# EAGLE design C64_ProtoBreakOut_Stabilized (EAGLE 9.0.1)
CNAME: Uffes Cart; CREVISION: 1.0; DESIGNER: Tomse @ http://retro-commodore.eu
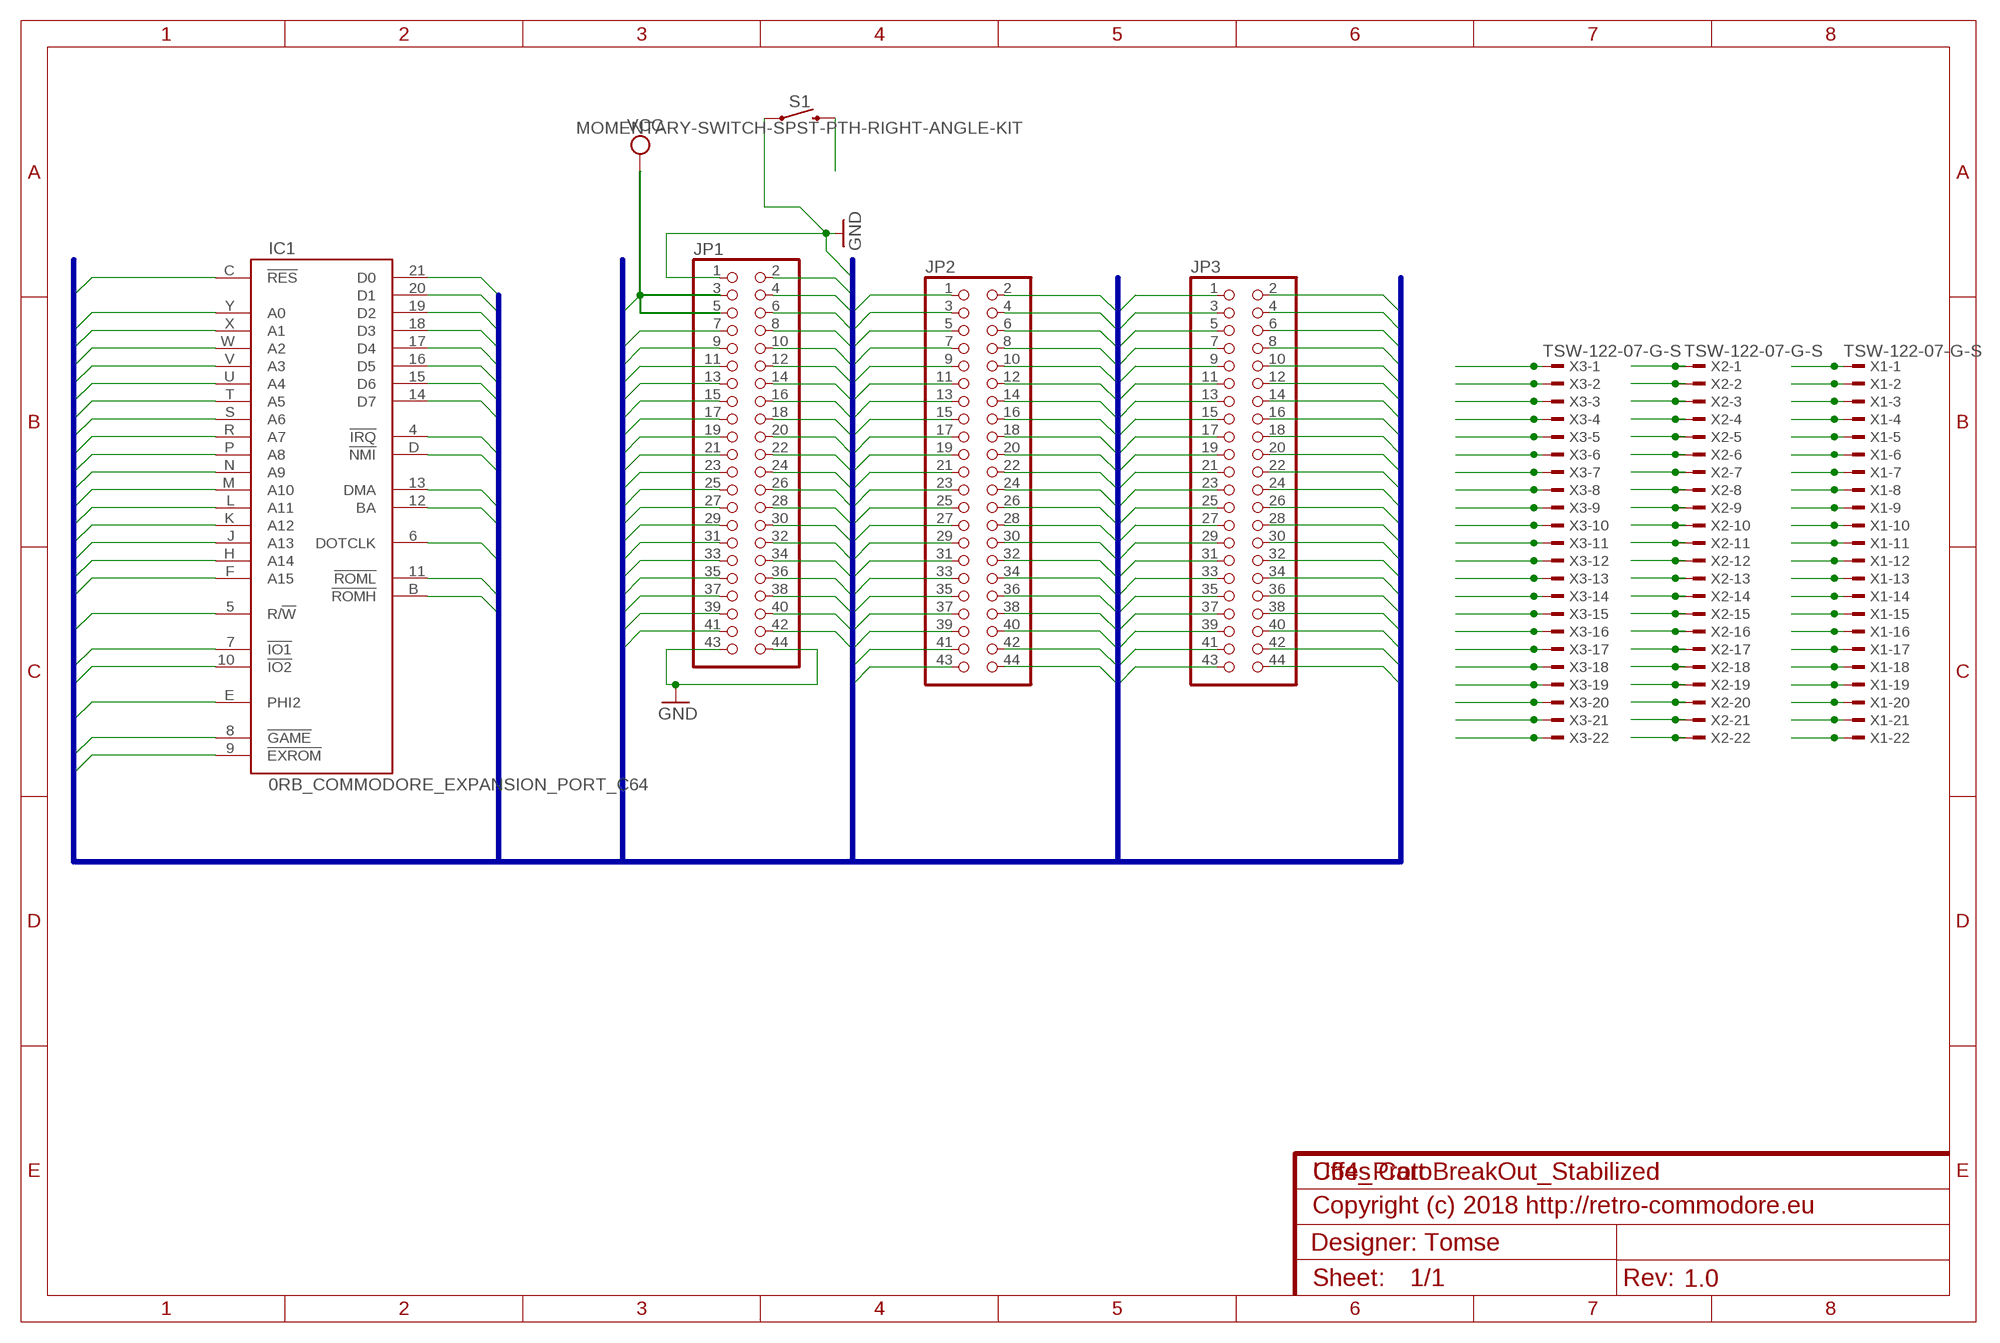
[diagram p0: schematic, sheet 1]
FRAME1 (FRAME-A4L): DESIGNER: Copyright (c) 2018 http://retro-commodore.eu

## Parts
IC1  0RB_COMMODORE_EXPANSION_PORT_C64  [0RB_COMMODORE_MA100-22-2]
JP1  PINHD-2X22  [2X22]
JP2  PINHD-2X22  [2X22]
JP3  PINHD-2X22  [2X22]
S1  MOMENTARY-SWITCH-SPST-PTH-RIGHT-ANGLE-KIT  [TACTILE_SWITCH_PTH_RIGHT_ANGLE_KIT]
X1  TSW-122-07-G-S  [TSW-122-XX-G-S]
X2  TSW-122-07-G-S  [TSW-122-XX-G-S]
X3  TSW-122-07-G-S  [TSW-122-XX-G-S]

## Nets
!DMA: IC1.13(DMA) JP1.25 JP2.25 JP3.25 X1.13 X2.13 X3.13
!EXROM: IC1.9(!EXROM) JP1.17 JP2.17 JP3.17 X1.9 X2.9 X3.9
!GAME: IC1.8(!GAME) JP1.15 JP2.15 JP3.15 X1.8 X2.8 X3.8
!IO1: IC1.7(!IO1) JP1.13 JP2.13 JP3.13 X1.7 X2.7 X3.7
!IO2: IC1.10(!IO2) JP1.19 JP2.19 JP3.19 X1.10 X2.10 X3.10
!IRQ: IC1.4(!IRQ) JP1.7 JP2.7 JP3.7 X1.4 X2.4 X3.4
!NMI: IC1.D(!NMI) JP1.8 JP2.8 JP3.8
!RES: IC1.C(!RES) JP1.6 JP2.6 JP3.6 S1.2
!ROMH: IC1.B(!ROMH) JP1.4 JP2.4 JP3.4
!ROML: IC1.11(!ROML) JP1.21 JP2.21 JP3.21 X1.11 X2.11 X3.11
A0: IC1.Y(A0) JP1.42 JP2.42 JP3.42
A1: IC1.X(A1) JP1.40 JP2.40 JP3.40
A2: IC1.W(A2) JP1.38 JP2.38 JP3.38
A3: IC1.V(A3) JP1.36 JP2.36 JP3.36
A4: IC1.U(A4) JP1.34 JP2.34 JP3.34
A5: IC1.T(A5) JP1.32 JP2.32 JP3.32
A6: IC1.S(A6) JP1.30 JP2.30 JP3.30
A7: IC1.R(A7) JP1.28 JP2.28 JP3.28
A8: IC1.P(A8) JP1.26 JP2.26 JP3.26
A9: IC1.N(A9) JP1.24 JP2.24 JP3.24
A10: IC1.M(A10) JP1.22 JP2.22 JP3.22
A11: IC1.L(A11) JP1.20 JP2.20 JP3.20
A12: IC1.K(A12) JP1.18 JP2.18 JP3.18
A13: IC1.J(A13) JP1.16 JP2.16 JP3.16
A14: IC1.H(A14) JP1.14 JP2.14 JP3.14
A15: IC1.F(A15) JP1.12 JP2.12 JP3.12
BA: IC1.12(BA) JP1.23 JP2.23 JP3.23 X1.12 X2.12 X3.12
D0: IC1.21(D0) JP1.41 JP2.41 JP3.41 X1.21 X2.21 X3.21
D1: IC1.20(D1) JP1.39 JP2.39 JP3.39 X1.20 X2.20 X3.20
D2: IC1.19(D2) JP1.37 JP2.37 JP3.37 X1.19 X2.19 X3.19
D3: IC1.18(D3) JP1.35 JP2.35 JP3.35 X1.18 X2.18 X3.18
D4: IC1.17(D4) JP1.33 JP2.33 JP3.33 X1.17 X2.17 X3.17
D5: IC1.16(D5) JP1.31 JP2.31 JP3.31 X1.16 X2.16 X3.16
D6: IC1.15(D6) JP1.29 JP2.29 JP3.29 X1.15 X2.15 X3.15
D7: IC1.14(D7) JP1.27 JP2.27 JP3.27 X1.14 X2.14 X3.14
DOTCLK: IC1.6(DOTCLK) JP1.11 JP2.11 JP3.11 X1.6 X2.6 X3.6
GND: JP1.1 JP1.2 JP1.43 JP1.44 JP2.1 JP2.2 JP2.43 JP2.44 JP3.1 JP3.2 JP3.43 JP3.44 S1.1 X1.1 X1.22 X2.1 X2.22 X3.1 X3.22
PHI2: IC1.E(PHI2) JP1.10 JP2.10 JP3.10
R!W: IC1.5(R/!W) JP1.9 JP2.9 JP3.9 X1.5 X2.5 X3.5
VCC: JP1.3 JP1.5 JP2.3 JP2.5 JP3.3 JP3.5 X1.2 X1.3 X2.2 X2.3 X3.2 X3.3

## Buses
A0,A1,A2,A3,A4,A5,A6,A7,A8,A9,A10,A11,A12,A13,A14,A15,PHI2,!NMI,!RES,!ROMH,GND,D0,D1,D2,D3,D4,D5,D6,D7,VCC,!IRQ,R!W,DOTCLK,!IO1,!IO2,!GAME,!EXROM,!ROML,BA,!DMA

## Notes on the sheet
- Designer: Tomse

## Power pins joined to a net without a drawn wire
GND: IC1.1(GND) IC1.22(GND) IC1.A(GND) IC1.Z(GND)
VCC: IC1.2(VCC) IC1.3(VCC)

## Library data of the parts
IC1 = C64CartridgeEdgeConnector:0RB_COMMODORE_EXPANSION_PORT_C64
JP1-JP3 = pinhead:PINHD-2X22: PIN HEADER
S1 = SparkFun-Switches:MOMENTARY-SWITCH-SPST: Momentary Switch (Pushbutton) - SPST Normally-open (NO) SPST momentary switches (buttons, pushbuttons). Variants PTH-12MM - 12mm square, through-hole Momentary Pushbutton Switch - 12mm Square <https://www.sparkfun.com/products/9190> (COM-09190) PTH-6.0MM, PTH-6.0MM-KIT - 6.0mm square, through-hole Mini Pushbutton Switch <https://www.sparkfun.com/products/97> (COM-00097) KIT package intended for soldering kit's - only one side of pads' copper is exposed. PTH-RIGHT-ANGLE-KIT - Right-angle, through-hole Right Angle Tactile Button <https://www.sparkfun.com/products/10791> - Used on SparkFun BigTime Watch Kit <https://www.sparkfun.com/products/11734> SMD-12MM - 12mm square, surface-mount Tactile Button - SMD (12mm) <https://www.sparkfun.com/products/12993> (COM-12993) Used on SparkFun PicoBoard <https://www.sparkfun.com/products/11888> SMD-4.5MM - 4.5mm Square Trackball Switch Used on SparkFun Blackberry Trackballer Breakout <https://www.sparkfun.com/products/13169> SMD-4.6MMX2.8MM - 4.60mm x 2.80mm, surface mount Used on SparkFun SAMD21 Mini Breakout <https://www.sparkfun.com/products/13664> SMD-5.2MM, SMD-5.2-REDUNDANT - 5.2mm square, surface-mount Mini Pushbutton Switch - SMD <https://www.sparkfun.com/products/8720> (COM-08720) Used on Arduino Pro Mini <https://www.sparkfun.com/products/11114> REDUNDANT package connects both switch circuits together SMD-6.0X3.5MM - 6.0 x 3.5mm, surface mount Momentary Reset Switch SMD <https://www.sparkfun.com/products/8229> (COM-08229) SMD-6.2MM-TALL - 6.2mm square, surface mount Tactile Button - SMD (6mm) <https://www.sparkfun.com/products/12992> Used on SparkFun Digital Sandbox <https://www.sparkfun.com/products/12651> SMD-RIGHT-ANGLE - Right-angle, surface mount Used on SparkFun Block for Intel® Edison - Arduino <https://www.sparkfun.com/products/13036>; PROD_ID: CONN-10672; SF_SKU: COM-10791
X1-X3 = con-samtec:TSW-122-*-G-S: THROUGH-HOLE .025" SQ POST HEADER Source: Samtec TSW.pdf; MF: Samtec Inc.; MPN: TSW-122-07-G-S

## Net classes
0 default: clearance 0.205 mm

## Board
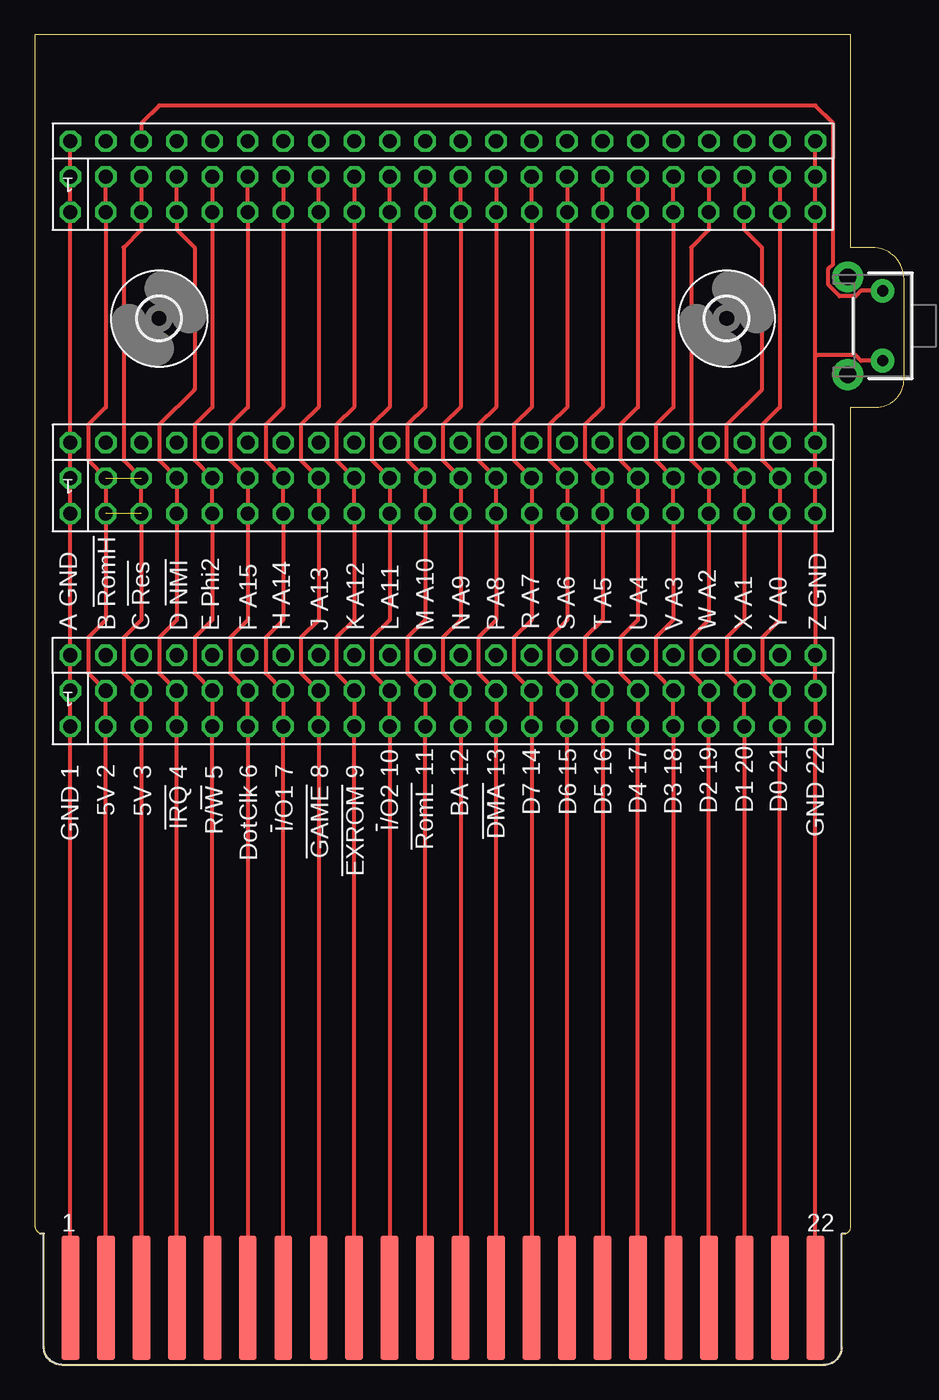
[diagram p1: board, top side]
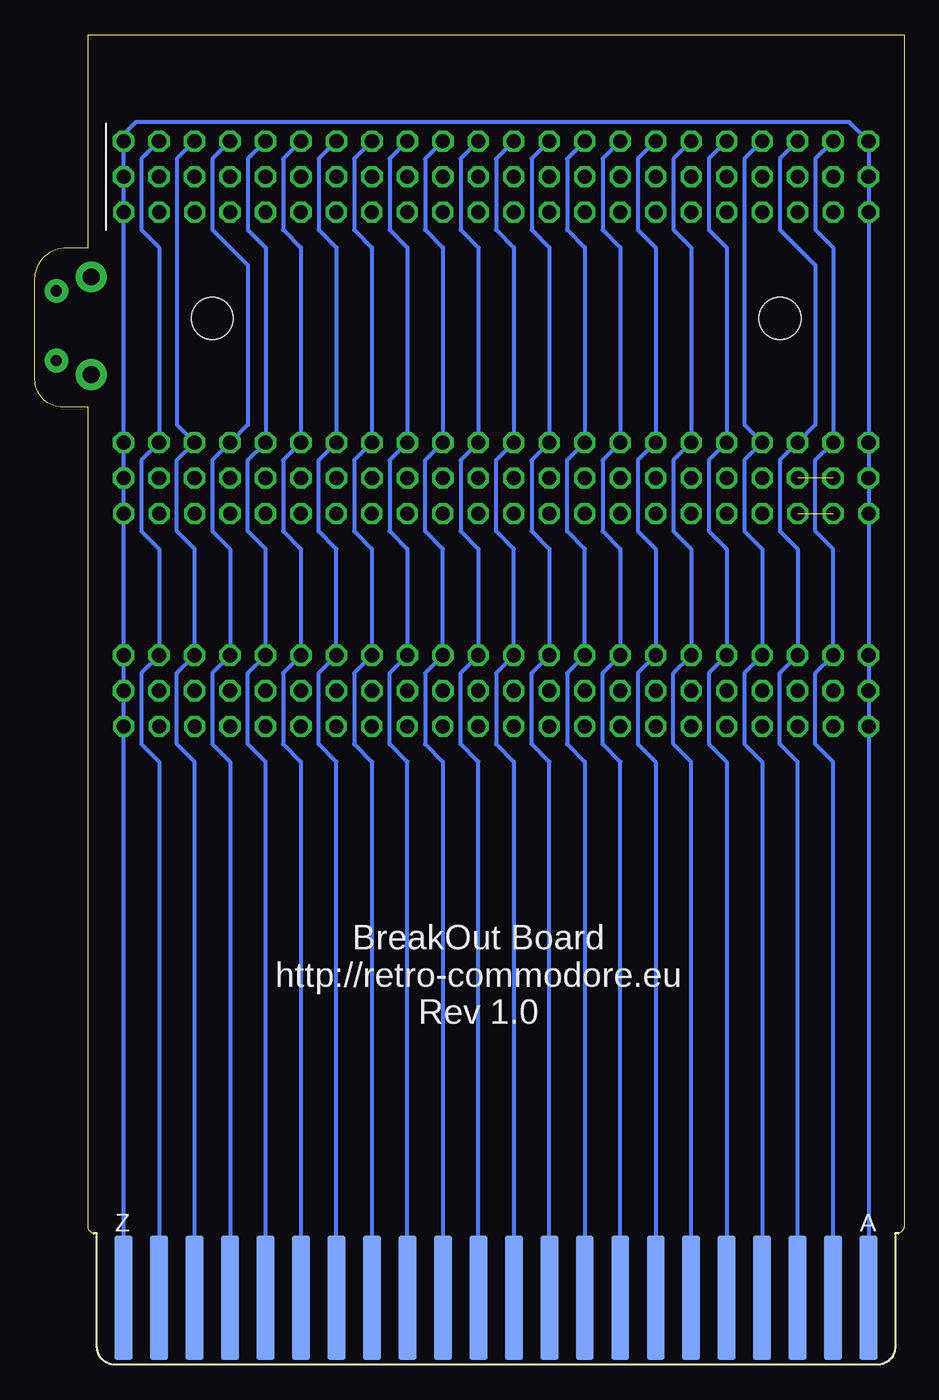
[diagram p2: board, bottom side, seen from below]

Size 62.23 x 95.24 mm. Coordinates in mm from the lower left corner, seen from the top.
Outline: 0.64,9.3 0.64,1.24 arc90 1.87,0 56.52,0 arc90 57.8,1.28 57.8,9.29 arc-90 57.91,9.4 57.94,9.4 arc90 58.42,9.87 58.42,68.58 60.24,68.58 arc90 62.23,70.57 62.23,77.74 arc90 59.96,80.01 58.42,80.01 58.42,95.24 0,95.24 0,9.93 arc90 0.53,9.4 arc-90 0.64,9.3
Copper layers (1*16): Top 0.035mm / dielectric 1.5mm / Bottom 0.035mm
Design rules "default": minimum track width 6mil, minimum drill 0.35mm, track to track 6mil, track to pad 6mil, pad to pad 6mil, via to via 6mil, smd to smd 6mil, copper to edge 40mil, drill to drill 6mil, minimum pad ring 10mil, minimum via ring 8mil, stop-mask expansion 4mil, vias tented up to drill 0mil, thermal gap 10mil

### Footprints (pad centres in the part's own frame; a part is rotated, then mirrored left to right if it is on the bottom)
0RB_COMMODORE_MA100-22-2 = smd 1.27 x 8.89: 1 -26.67,-0.305; 2 -24.13,-0.305; 3 -21.59,-0.305; 4 -19.05,-0.305; 5 -16.51,-0.305; 6 -13.97,-0.305; 7 -11.43,-0.305; 8 -8.89,-0.305; 9 -6.35,-0.305; 10 -3.81,-0.305; 11 -1.27,-0.305; 12 1.27,-0.305; 13 3.81,-0.305; 14 6.35,-0.305; 15 8.89,-0.305; 16 11.43,-0.305; 17 13.97,-0.305; 18 16.51,-0.305; 19 19.05,-0.305; 20 21.59,-0.305; 21 24.13,-0.305; 22 26.67,-0.305 | smd 1.27 x 8.89 bottom: A -26.67,-0.305; B -24.13,-0.305; C -21.59,-0.305; D -19.05,-0.305; E -16.51,-0.305; F -13.97,-0.305; H -11.43,-0.305; J -8.89,-0.305; K -6.35,-0.305; L -3.81,-0.305; M -1.27,-0.305; N 1.27,-0.305; P 3.81,-0.305; R 6.35,-0.305; S 8.89,-0.305; T 11.43,-0.305; U 13.97,-0.305; V 16.51,-0.305; W 19.05,-0.305; X 21.59,-0.305; Y 24.13,-0.305; Z 26.67,-0.305
2X22 = drill 1.016 octagon: 1 -25.4,-1.27; 2 -25.4,1.27; 3 -22.86,-1.27; 4 -22.86,1.27; 5 -20.32,-1.27; 6 -20.32,1.27; 7 -17.78,-1.27; 8 -17.78,1.27; 9 -15.24,-1.27; 10 -15.24,1.27; 11 -12.7,-1.27; 12 -12.7,1.27; 13 -10.16,-1.27; 14 -10.16,1.27; 15 -7.62,-1.27; 16 -7.62,1.27; 17 -5.08,-1.27; 18 -5.08,1.27; 19 -2.54,-1.27; 20 -2.54,1.27; 21 0,-1.27; 22 0,1.27; 23 2.54,-1.27; 24 2.54,1.27; 25 5.08,-1.27; 26 5.08,1.27; 27 7.62,-1.27; 28 7.62,1.27; 29 10.16,-1.27; 30 10.16,1.27; 31 12.7,-1.27; 32 12.7,1.27; 33 15.24,-1.27; 34 15.24,1.27; 35 17.78,-1.27; 36 17.78,1.27; 37 20.32,-1.27; 38 20.32,1.27; 39 22.86,-1.27; 40 22.86,1.27; 41 25.4,-1.27; 42 25.4,1.27; 43 27.94,-1.27; 44 27.94,1.27
TACTILE_SWITCH_PTH_RIGHT_ANGLE_KIT = drill 0.8 pad 1.7: 1 -2.5,0; 2 2.5,0 | drill 1.2 pad 2.2: ANCHOR1 -3.5,2.5; ANCHOR2 3.5,2.5
3,0 = hole 3: 0,0
TSW-122-XX-G-S = drill 1 pad 1.5 octagon: 1 26.67,0; 2 24.13,0; 3 21.59,0; 4 19.05,0; 5 16.51,0; 6 13.97,0; 7 11.43,0; 8 8.89,0; 9 6.35,0; 10 3.81,0; 11 1.27,0; 12 -1.27,0; 13 -3.81,0; 14 -6.35,0; 15 -8.89,0; 16 -11.43,0; 17 -13.97,0; 18 -16.51,0; 19 -19.05,0; 20 -21.59,0; 21 -24.13,0; 22 -26.67,0

### Placement (x,y rotation side)
IC1  29.21,5.08 0 top
JP1  27.94,64.77 0 top
JP2  27.94,49.53 0 top
JP3  27.94,86.36 0 top
S1  60.69,74.41 90 top
U$1  [3,0]  8.89,74.93 0 top
U$2  [3,0]  49.53,74.93 0 top
X1  29.21,45.72 180 top
X2  29.21,60.96 180 top
X3  29.21,82.55 180 top

### Tracks (layer width: path | path; a pad name or v marks a point on that pad's centre or on a via)
!DMA
  Top 0.3: JP3.25 X3.13 33.02,68.58 31.75,67.31 31.75,64.77 JP1.25 X2.13 33.02,53.34 31.75,52.07 31.75,49.53 JP2.25 X1.13 IC1.13
!EXROM
  Top 0.3: JP3.17 X3.9 22.86,68.58 21.59,67.31 21.59,64.77 JP1.17 X2.9 22.86,53.34 21.59,52.07 21.59,49.53 JP2.17 X1.9 IC1.9
!GAME
  Top 0.3: JP3.15 X3.8 20.32,68.58 19.05,67.31 19.05,64.77 JP1.15 X2.8 20.32,53.34 19.05,52.07 19.05,49.53 JP2.15 X1.8 IC1.8
!IO1
  Top 0.3: JP3.13 X3.7 17.78,68.58 16.51,67.31 16.51,64.77 JP1.13 X2.7 17.78,53.34 16.51,52.07 16.51,49.53 JP2.13 X1.7 IC1.7
!IO2
  Top 0.3: JP3.19 X3.10 25.4,68.58 24.13,67.31 24.13,64.77 JP1.19 X2.10 25.4,53.34 24.13,52.07 24.13,49.53 JP2.19 X1.10 IC1.10
!IRQ
  Top 0.3: JP3.7 X3.4 10.16,81.28 11.43,80.01 11.43,69.85 8.89,67.31 8.89,64.77 JP1.7 X2.4 10.16,53.34 8.89,52.07 8.89,49.53 JP2.7 X1.4 IC1.4
!NMI
  Bottom 0.3: JP3.8 11.43,86.36 11.43,69.85 11.43,68.58 11.43,67.31 JP1.8 11.43,64.77 11.43,59.69 10.16,58.42 JP2.8 11.43,49.53 11.43,44.45 10.16,43.18 IC1.D
!RES
  Top 0.3: S1.2 59.15,76.91 58.77,76.53 57.62,76.53 56.81,77.34 56.81,78.48 57.15,78.82 57.15,88.9 55.88,90.17 8.89,90.17 7.62,88.9 JP3.6
  Bottom 0.3: JP3.6 8.89,86.36 8.89,81.28 6.35,78.74 6.35,68.58 6.35,67.31 JP1.6 8.89,64.77 8.89,59.69 7.62,58.42 JP2.6 8.89,49.53 8.89,44.45 7.62,43.18 IC1.C
!ROMH
  Bottom 0.3: IC1.B 5.08,43.18 6.35,44.45 6.35,49.53 JP2.4 5.08,58.42 6.35,59.69 6.35,64.77 JP1.4 5.08,80.01 6.35,81.28 6.35,86.36 JP3.4
!ROML
  Top 0.3: JP3.21 X3.11 27.94,68.58 26.67,67.31 26.67,64.77 JP1.21 X2.11 27.94,53.34 26.67,52.07 26.67,49.53 JP2.21 X1.11 IC1.11
A0
  Bottom 0.3: JP3.42 54.61,86.36 54.61,81.28 53.34,80.01 JP1.42 54.61,64.77 54.61,59.69 53.34,58.42 JP2.42 54.61,49.53 54.61,44.45 53.34,43.18 IC1.Y
A1
  Bottom 0.3: JP3.40 52.07,86.36 52.07,67.31 JP1.40 52.07,64.77 52.07,59.69 50.8,58.42 JP2.40 52.07,49.53 52.07,44.45 50.8,43.18 IC1.X
A2
  Bottom 0.3: JP3.38 49.53,86.36 49.53,81.28 46.99,78.74 46.99,67.31 JP1.38 49.53,64.77 49.53,59.69 48.26,58.42 JP2.38 49.53,49.53 49.53,44.45 48.26,43.18 IC1.W
A3
  Bottom 0.3: JP3.36 46.99,86.36 46.99,81.28 45.72,80.01 JP1.36 46.99,64.77 46.99,59.69 45.72,58.42 JP2.36 46.99,49.53 46.99,44.45 45.72,43.18 IC1.V
A4
  Bottom 0.3: JP3.34 44.45,86.36 44.45,81.28 43.18,80.01 JP1.34 44.45,64.77 44.45,59.69 43.18,58.42 JP2.34 44.45,49.53 44.45,44.45 43.18,43.18 IC1.U
A5
  Bottom 0.3: JP3.32 41.91,86.36 41.91,81.28 40.64,80.01 JP1.32 41.91,64.77 41.91,59.69 40.64,58.42 JP2.32 41.91,49.53 41.91,44.45 40.64,43.18 IC1.T
A6
  Bottom 0.3: JP3.30 39.37,86.36 39.37,81.28 38.1,80.01 JP1.30 39.37,64.77 39.37,59.69 38.1,58.42 JP2.30 39.37,49.53 39.37,44.45 38.1,43.18 IC1.S
A7
  Bottom 0.3: JP3.28 36.83,86.36 36.83,81.28 35.56,80.01 JP1.28 36.83,64.77 36.83,59.69 35.56,58.42 JP2.28 36.83,49.53 36.83,44.45 35.56,43.18 IC1.R
A8
  Bottom 0.3: JP3.26 34.29,86.36 34.29,81.28 33.02,80.01 JP1.26 34.29,64.77 34.29,59.69 33.02,58.42 JP2.26 34.29,49.53 34.29,44.45 33.02,43.18 IC1.P
A9
  Bottom 0.3: JP3.24 31.75,86.36 31.75,81.28 30.48,80.01 JP1.24 31.75,64.77 31.75,59.69 30.48,58.42 JP2.24 31.75,49.53 31.75,44.45 30.48,43.18 IC1.N
A10
  Bottom 0.3: JP3.22 29.21,86.36 29.21,81.28 27.94,80.01 JP1.22 29.21,64.77 29.21,59.69 27.94,58.42 JP2.22 29.21,49.53 29.21,44.45 27.94,43.18 IC1.M
A11
  Bottom 0.3: JP3.20 26.67,86.36 26.67,81.28 25.4,80.01 JP1.20 26.67,64.77 26.67,59.69 25.4,58.42 JP2.20 26.67,49.53 26.67,44.45 25.4,43.18 IC1.L
A12
  Bottom 0.3: JP3.18 24.13,86.36 24.13,81.28 22.86,80.01 JP1.18 24.13,64.77 24.13,59.69 22.86,58.42 JP2.18 24.13,49.53 24.13,44.45 22.86,43.18 IC1.K
A13
  Bottom 0.3: JP3.16 21.59,86.36 21.59,81.28 20.32,80.01 JP1.16 21.59,64.77 21.59,59.69 20.32,58.42 JP2.16 21.59,49.53 21.59,44.45 20.32,43.18 IC1.J
A14
  Bottom 0.3: JP3.14 19.05,86.36 19.05,81.28 17.78,80.01 JP1.14 19.05,64.77 19.05,59.69 17.78,58.42 JP2.14 19.05,49.53 19.05,44.45 17.78,43.18 IC1.H
A15
  Bottom 0.3: JP3.12 16.51,86.36 16.51,81.28 15.24,80.01 JP1.12 16.51,64.77 16.51,59.69 15.24,58.42 JP2.12 16.51,49.53 16.51,44.45 15.24,43.18 IC1.F
BA
  Top 0.3: JP3.23 X3.12 30.48,68.58 29.21,67.31 29.21,64.77 JP1.23 X2.12 30.48,53.34 29.21,52.07 29.21,49.53 JP2.23 X1.12 IC1.12
D0
  Top 0.3: JP3.41 X3.21 53.34,68.58 52.07,67.31 52.07,64.77 JP1.41 X2.21 53.34,53.34 52.07,52.07 52.07,49.53 JP2.41 X1.21 IC1.21
D1
  Top 0.3: JP3.39 X3.20 50.8,81.28 52.07,80.01 52.07,69.85 49.53,67.31 49.53,64.77 JP1.39 X2.20 50.8,53.34 49.53,52.07 49.53,49.53 JP2.39 X1.20 IC1.20
D2
  Top 0.3: JP3.37 X3.19 48.26,81.28 46.99,80.01 46.99,64.77 JP1.37 X2.19 48.26,53.34 46.99,52.07 46.99,49.53 JP2.37 X1.19 IC1.19
D3
  Top 0.3: JP3.35 X3.18 45.72,68.58 44.45,67.31 44.45,64.77 JP1.35 X2.18 45.72,53.34 44.45,52.07 44.45,49.53 JP2.35 X1.18 IC1.18
D4
  Top 0.3: JP3.33 X3.17 43.18,68.58 41.91,67.31 41.91,64.77 JP1.33 X2.17 43.18,53.34 41.91,52.07 41.91,49.53 JP2.33 X1.17 IC1.17
D5
  Top 0.3: JP3.31 X3.16 40.64,68.58 39.37,67.31 39.37,64.77 JP1.31 X2.16 40.64,53.34 39.37,52.07 39.37,49.53 JP2.31 X1.16 IC1.16
D6
  Top 0.3: JP3.29 X3.15 38.1,68.58 36.83,67.31 36.83,64.77 JP1.29 X2.15 38.1,53.34 36.83,52.07 36.83,49.53 JP2.29 X1.15 IC1.15
D7
  Top 0.3: JP3.27 X3.14 35.56,68.58 34.29,67.31 34.29,64.77 JP1.27 X2.14 35.56,53.34 34.29,52.07 34.29,49.53 JP2.27 X1.14 IC1.14
DOTCLK
  Top 0.3: JP3.11 X3.6 15.24,68.58 13.97,67.31 13.97,64.77 JP1.11 X2.6 15.24,53.34 13.97,52.07 13.97,49.53 JP2.11 X1.6 IC1.6
GND
  Top 0.152: IC1.A X1.1 JP2.1 JP2.2 X2.1 JP1.1 JP1.2 X3.1 JP3.1 JP3.2
  Top 0.3: IC1.Z X1.22 JP2.43 JP2.44 X2.22 JP1.43 | JP1.43 JP1.44 55.88,72.39 | 55.88,72.39 X3.22 JP3.43 JP3.44 | 55.98,63.4 JP1.43 | S1.1 59.15,71.91 58.77,72.29 55.98,72.29 55.88,72.39 | IC1.A JP3.2
  Bottom 0.3: IC1.A JP3.2 3.91,89 55,89 55.88,88.12 JP3.44 55.88,87 IC1.Z
PHI2
  Bottom 0.3: JP3.10 13.97,86.36 13.97,81.28 12.7,80.01 JP1.10 13.97,64.77 13.97,59.69 12.7,58.42 JP2.10 13.97,49.53 13.97,44.45 12.7,43.18 IC1.E
R!W
  Top 0.3: JP3.9 X3.5 12.7,68.58 11.43,67.31 11.43,64.77 JP1.9 X2.5 12.7,53.34 11.43,52.07 11.43,49.53 JP2.9 X1.5 IC1.5
VCC  (2 unrouted)
  Top 0.3: JP3.5 X3.3 7.62,81.28 6.35,80.01 6.35,64.77 JP1.5 X2.3 7.62,53.34 6.35,52.07 6.35,49.53 JP2.5 X1.3 IC1.3 | JP3.3 X3.2 5.08,68.58 3.81,67.31 3.81,64.77 JP1.3 X2.2 5.08,53.34 3.81,52.07 3.81,49.53 JP2.3 X1.2 IC1.2

### Text on the board
tNames: A GND | B !RomH! | C !Res! | D !NMI! | E Phi2 | F A15 | H A14 | J A13 | K A12 | L A11 | M A10 | N A9 | P A8 | R A7 | S A6 | T A5 | U A4 | V A3 | W A2 | X A1 | Y A0 | Z GND | !I!/O2 10 | !RomL! 11 | BA 12 | !DMA! 13 | D7 14 | D6 15 | D5 16 | D4 17 | D3 18 | D2 19 | D1 20 | D0 21 | GND 22 | GND 1 | 5V 2 | 5V 3 | !IRQ! 4 | R/!W! 5 | DotClk 6 | !I!/O1 7 | !GAME! 8 | !EXROM! 9
bNames: BreakOut Board / http://retro-commodore.eu / Rev 1.0